# Altium project J65VIA.PrjPcb
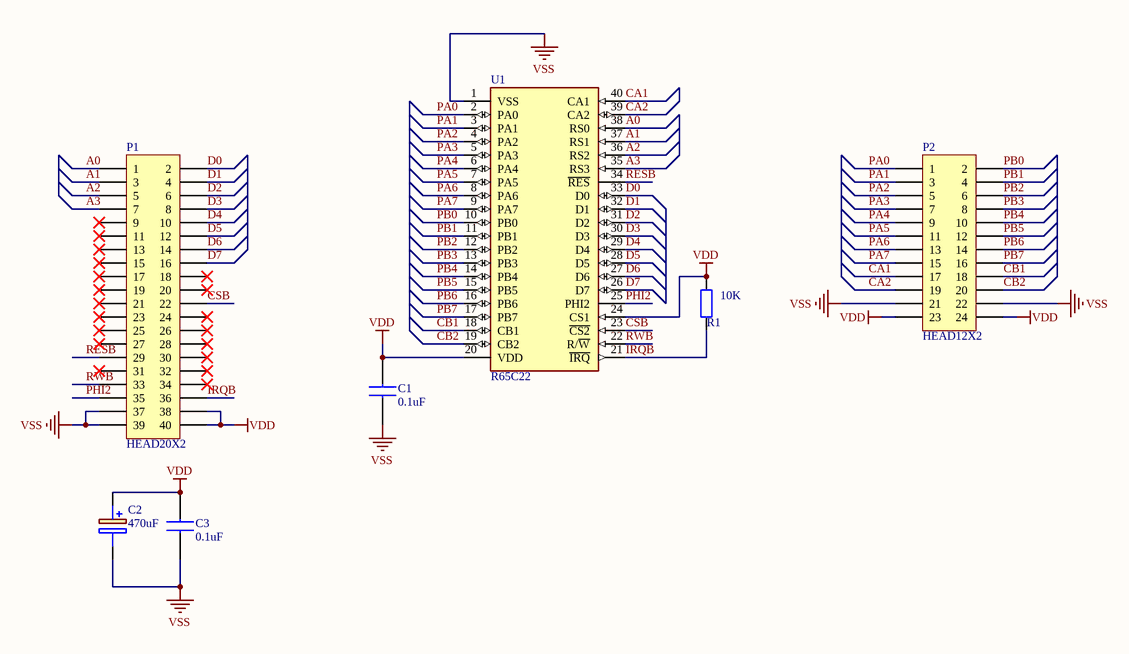
[diagram p0: J65VIA.SchDoc]
1 sheet, 7 parts. Net scope: global (net labels, ports and power ports of the same name join across sheets).
Board file: J65VIA.PcbDoc

## Sheet J65VIA.SchDoc
size A4

### Parts
C1  0.1uF  [CAP508]
C2  470uF  [CAP8X12]
C3  0.1uF  [CAP508]
P1  HEAD20X2  [HD20X2]
P2  HEAD12X2  [HD12X2]
R1  10K  [AXIAL-0.4]
U1  R65C22  [DIP40]

### Nets
VDD: C1.1 C2.1(+) C3.1 P1.38 P1.40 P2.23 P2.24 R1.1 U1.20(VDD) U1.24(CS1)
VSS: C1.2 C2.2(-) C3.2 P1.37 P1.39 P2.21 P2.22 U1.1(VSS)
A0: P1.1 U1.38(RS0)
A1: P1.3 U1.37(RS1)
A2: P1.5 U1.36(RS2)
A3: P1.7 U1.35(RS3)
CA1: P2.17 U1.40(CA1)
CA2: P2.19 U1.39(CA2)
CB1: P2.18 U1.18(CB1)
CB2: P2.20 U1.19(CB2)
CSB: P1.22 U1.23(~{CS2})
D0: P1.2 U1.33(D0)
D1: P1.4 U1.32(D1)
D2: P1.6 U1.31(D2)
D3: P1.8 U1.30(D3)
D4: P1.10 U1.29(D4)
D5: P1.12 U1.28(D5)
D6: P1.14 U1.27(D6)
D7: P1.16 U1.26(D7)
IRQB: P1.36 R1.2 U1.21(~{IRQ})
PA0: P2.1 U1.2(PA0)
PA1: P2.3 U1.3(PA1)
PA2: P2.5 U1.4(PA2)
PA3: P2.7 U1.5(PA3)
PA4: P2.9 U1.6(PA4)
PA5: P2.11 U1.7(PA5)
PA6: P2.13 U1.8(PA6)
PA7: P2.15 U1.9(PA7)
PB0: P2.2 U1.10(PB0)
PB1: P2.4 U1.11(PB1)
PB2: P2.6 U1.12(PB2)
PB3: P2.8 U1.13(PB3)
PB4: P2.10 U1.14(PB4)
PB5: P2.12 U1.15(PB5)
PB6: P2.14 U1.16(PB6)
PB7: P2.16 U1.17(PB7)
PHI2: P1.35 U1.25(PHI2)
RESB: P1.29 U1.34(~{RES})
RWB: P1.33 U1.22(R/~{W})

Not connected (* = marked no-connect by the designer): P1 9* 11* 13* 15* 17* 18* 19* 20* 21* 23* 24* 25* 26* 27* 28* 30* 31* 32* 34*

### Notes on the sheet
- Title
- Size:
- Date:
- A4
- Number:
- Time:
- Revision:
- Sheet
- of
- File:

### Library data of the parts
C1 C3 = CAP1
C2 = CAP2
R1 = RES1
P1 = HEAD20X2: LatestRevisionDate: 17-Jul-2002; LatestRevisionNote: Re-released for DXP Platform.; Publisher: Altium Limited
P2 = HEAD12X2: LatestRevisionDate: 17-Jul-2002; LatestRevisionNote: Re-released for DXP Platform.; Publisher: Altium Limited